# Altium schematic sheet LED.SchDoc
size 594 x 420 mm; Address1: Address1; Address2: Address2; Address3: Address3; Address4: Address4; DocumentNumber: АБВГ.123456.001 Э3; SheetNumber: 2; SheetTotal: 3; Scale: 1:1; DocumentType: Схема электрическая принципиальная; FirstReferrence: АБВГ.123456.001
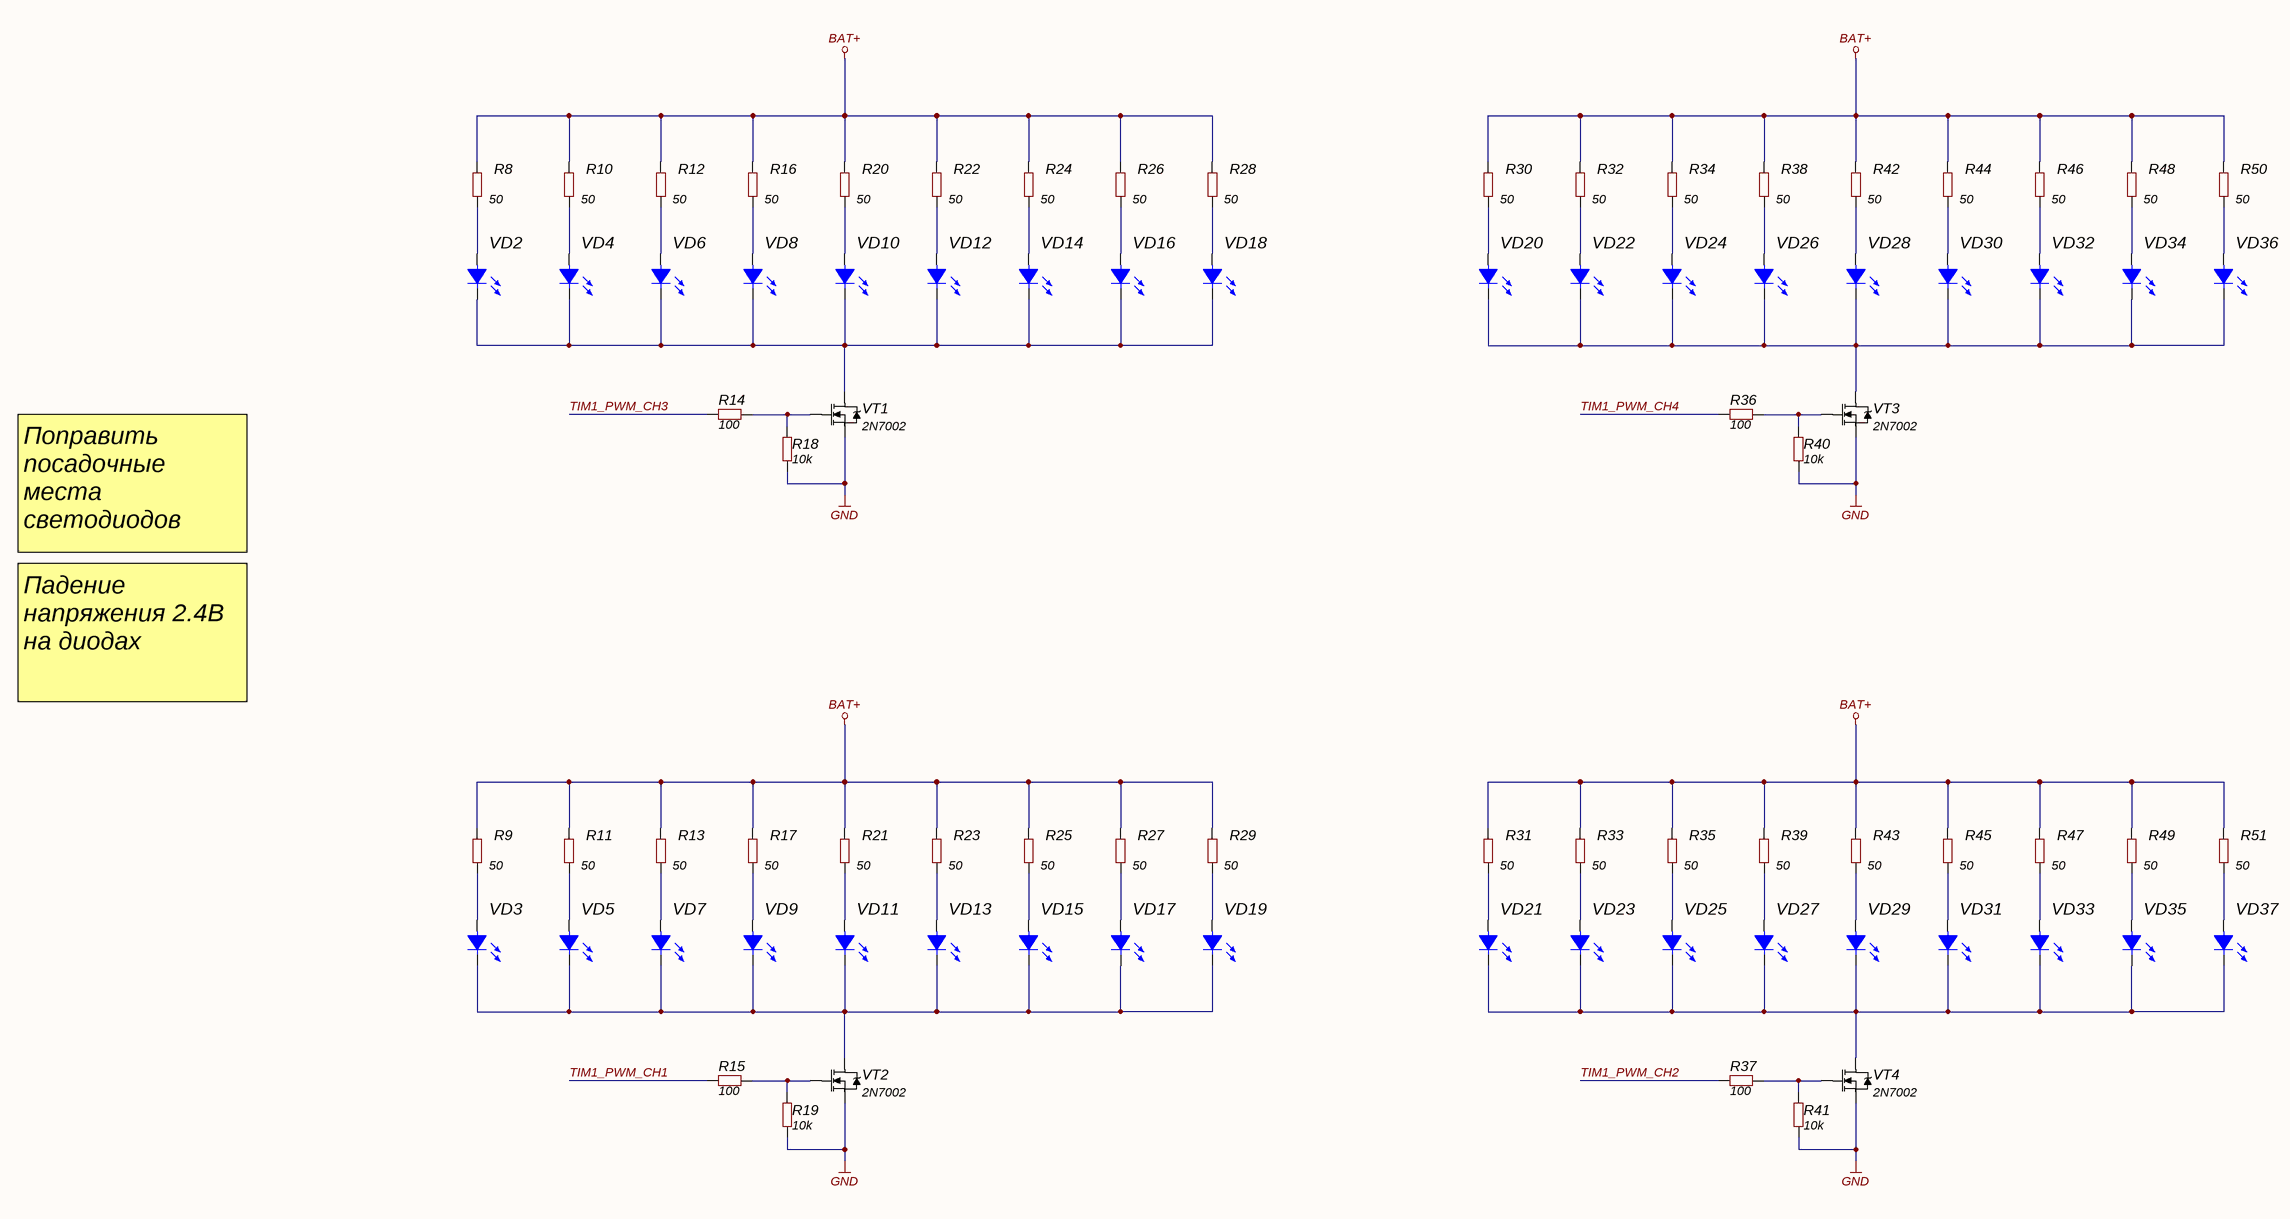
[diagram p0: LED.SchDoc]

## Parts
R8  value 50  [RES: 0603]
R9  value 50  [RES: 0603]
R10  value 50  [RES: 0603]
R11  value 50  [RES: 0603]
R12  value 50  [RES: 0603]
R13  value 50  [RES: 0603]
R14  value 100  [RES: 0603]
R15  value 100  [RES: 0603]
R16  value 50  [RES: 0603]
R17  value 50  [RES: 0603]
R18  value 10k  [RES: 0603]
R19  value 10k  [RES: 0603]
R20  value 50  [RES: 0603]
R21  value 50  [RES: 0603]
R22  value 50  [RES: 0603]
R23  value 50  [RES: 0603]
R24  value 50  [RES: 0603]
R25  value 50  [RES: 0603]
R26  value 50  [RES: 0603]
R27  value 50  [RES: 0603]
R28  value 50  [RES: 0603]
R29  value 50  [RES: 0603]
R30  value 50  [RES: 0603]
R31  value 50  [RES: 0603]
R32  value 50  [RES: 0603]
R33  value 50  [RES: 0603]
R34  value 50  [RES: 0603]
R35  value 50  [RES: 0603]
R36  value 100  [RES: 0603]
R37  value 100  [RES: 0603]
R38  value 50  [RES: 0603]
R39  value 50  [RES: 0603]
R40  value 10k  [RES: 0603]
R41  value 10k  [RES: 0603]
R42  value 50  [RES: 0603]
R43  value 50  [RES: 0603]
R44  value 50  [RES: 0603]
R45  value 50  [RES: 0603]
R46  value 50  [RES: 0603]
R47  value 50  [RES: 0603]
R48  value 50  [RES: 0603]
R49  value 50  [RES: 0603]
R50  value 50  [RES: 0603]
R51  value 50  [RES: 0603]
VD2  (no value)  [LED: 1206Y]
VD3  (no value)  [LED: 1206Y]
VD4  (no value)  [LED: 1206Y]
VD5  (no value)  [LED: 1206Y]
VD6  (no value)  [LED: 1206Y]
VD7  (no value)  [LED: 1206Y]
VD8  (no value)  [LED: 1206Y]
VD9  (no value)  [LED: 1206Y]
VD10  (no value)  [LED: 1206Y]
VD11  (no value)  [LED: 1206Y]
VD12  (no value)  [LED: 1206Y]
VD13  (no value)  [LED: 1206Y]
VD14  (no value)  [LED: 1206Y]
VD15  (no value)  [LED: 1206Y]
VD16  (no value)  [LED: 1206Y]
VD17  (no value)  [LED: 1206Y]
VD18  (no value)  [LED: 1206Y]
VD19  (no value)  [LED: 1206Y]
VD20  (no value)  [LED: 1206Y]
VD21  (no value)  [LED: 1206Y]
VD22  (no value)  [LED: 1206Y]
VD23  (no value)  [LED: 1206Y]
VD24  (no value)  [LED: 1206Y]
VD25  (no value)  [LED: 1206Y]
VD26  (no value)  [LED: 1206Y]
VD27  (no value)  [LED: 1206Y]
VD28  (no value)  [LED: 1206Y]
VD29  (no value)  [LED: 1206Y]
VD30  (no value)  [LED: 1206Y]
VD31  (no value)  [LED: 1206Y]
VD32  (no value)  [LED: 1206Y]
VD33  (no value)  [LED: 1206Y]
VD34  (no value)  [LED: 1206Y]
VD35  (no value)  [LED: 1206Y]
VD36  (no value)  [LED: 1206Y]
VD37  (no value)  [LED: 1206Y]
VT1  PartNumber: 2N7002  [SOT23]
VT2  PartNumber: 2N7002  [SOT23]
VT3  PartNumber: 2N7002  [SOT23]
VT4  PartNumber: 2N7002  [SOT23]

## Nets
BAT+: R8.2 R9.2 R10.2 R11.2 R12.2 R13.2 R16.2 R17.2 R20.2 R21.2 R22.2 R23.2 R24.2 R25.2 R26.2 R27.2 R28.2 R29.2 R30.2 R31.2 R32.2 R33.2 R34.2 R35.2 R38.2 R39.2 R42.2 R43.2 R44.2 R45.2 R46.2 R47.2 R48.2 R49.2 R50.2 R51.2
GND: R18.1 R19.1 R40.1 R41.1 VT1.2(S) VT2.2(S) VT3.2(S) VT4.2(S)
TIM1_PWM_CH1: R15.1
TIM1_PWM_CH2: R37.1
TIM1_PWM_CH3: R14.1
TIM1_PWM_CH4: R36.1
NetR8_1: R8.1 VD2.1(A)
NetR9_1: R9.1 VD3.1(A)
NetR10_1: R10.1 VD4.1(A)
NetR11_1: R11.1 VD5.1(A)
NetR12_1: R12.1 VD6.1(A)
NetR13_1: R13.1 VD7.1(A)
NetR14_2: R14.2 R18.2 VT1.1(G)
NetR15_2: R15.2 R19.2 VT2.1(G)
NetR16_1: R16.1 VD8.1(A)
NetR17_1: R17.1 VD9.1(A)
NetR20_1: R20.1 VD10.1(A)
NetR21_1: R21.1 VD11.1(A)
NetR22_1: R22.1 VD12.1(A)
NetR23_1: R23.1 VD13.1(A)
NetR24_1: R24.1 VD14.1(A)
NetR25_1: R25.1 VD15.1(A)
NetR26_1: R26.1 VD16.1(A)
NetR27_1: R27.1 VD17.1(A)
NetR28_1: R28.1 VD18.1(A)
NetR29_1: R29.1 VD19.1(A)
NetR30_1: R30.1 VD20.1(A)
NetR31_1: R31.1 VD21.1(A)
NetR32_1: R32.1 VD22.1(A)
NetR33_1: R33.1 VD23.1(A)
NetR34_1: R34.1 VD24.1(A)
NetR35_1: R35.1 VD25.1(A)
NetR36_2: R36.2 R40.2 VT3.1(G)
NetR37_2: R37.2 R41.2 VT4.1(G)
NetR38_1: R38.1 VD26.1(A)
NetR39_1: R39.1 VD27.1(A)
NetR42_1: R42.1 VD28.1(A)
NetR43_1: R43.1 VD29.1(A)
NetR44_1: R44.1 VD30.1(A)
NetR45_1: R45.1 VD31.1(A)
NetR46_1: R46.1 VD32.1(A)
NetR47_1: R47.1 VD33.1(A)
NetR48_1: R48.1 VD34.1(A)
NetR49_1: R49.1 VD35.1(A)
NetR50_1: R50.1 VD36.1(A)
NetR51_1: R51.1 VD37.1(A)
NetVD2_2: VD2.2(C) VD4.2(C) VD6.2(C) VD8.2(C) VD10.2(C) VD12.2(C) VD14.2(C) VD16.2(C) VD18.2(C) VT1.3(D)
NetVD3_2: VD3.2(C) VD5.2(C) VD7.2(C) VD9.2(C) VD11.2(C) VD13.2(C) VD15.2(C) VD17.2(C) VD19.2(C) VT2.3(D)
NetVD20_2: VD20.2(C) VD22.2(C) VD24.2(C) VD26.2(C) VD28.2(C) VD30.2(C) VD32.2(C) VD34.2(C) VD36.2(C) VT3.3(D)
NetVD21_2: VD21.2(C) VD23.2(C) VD25.2(C) VD27.2(C) VD29.2(C) VD31.2(C) VD33.2(C) VD35.2(C) VD37.2(C) VT4.3(D)

## Notes on the sheet
- Поправить посадочные места светодиодов
- Падение напряжения 2.4В на диодах
- Перв. примен.
- Справ. №
- Подп. и дата
- Инв. № дубл.
- Взам. инв. №
- Инв. № подл.
- Изм.
- Лист
- № докум.
- Подп.
- Дата
- 2.106-A2
- Копировал
- Формат А2

## Library data of the parts
R8-R51 = Resistor_0603: Manufacturer: Yageo; PartNumber: RC0603JR-07100RL; TypeResistor: Resistor film; Power: 0.1W; Package: 0603; HelpURL: https://www.digikey.com/product-detail/en/yageo/RC0603JR-07100RL/311-100GRCT-ND/729644; ValueManufacturerPartNumber: =TypeResistor+', '+Value+', '+Tolerance+', '+Package+', '+Power+', '+Temperature; Temperature: -55...+125°C
VD2-VD37 = LED_single: ValueManufacturerPartNumber: LED, Green, *, *, *, -55...+150°C; TypeDiode: LED; ColorParameter: Green; Manufacturer: *; Package: *; HelpURL: *; Temperature: -55...+150°C; Current: *; VoltageDrop: *; PartNumber: *; Color: GREEN
VT1-VT4 = MOSFET_N_132: Manufacturer: Infineon Technologies; ValueManufacturerPartNumber: MOSFET N-channel transistor, 80V, 7A, 9.1nC, 2.5W, 34mOhm, 756pF, 8-TDSON, -55...+150°C; TypeTransistor: MOSFET N-channel transistor; VoltageDS: 80V; CurrentDS: 7A; RDS: 34mOhm; GateCharge: 9.1nC; InputCapacitor: 756pF; MaxPower: 2.5W; Package: 8-TDSON; HelpURL: https://www.digikey.com/product-detail/en/infineon-technologies/BSC340N08NS3GATMA1/BSC340N08NS3GATMA1TR-ND/2080655; Temperature: -55...+150°C